# Altium schematic sheet 5V-and-3V3-ldo.SchDoc
size A; SheetNumber: 5; SheetTotal: 8
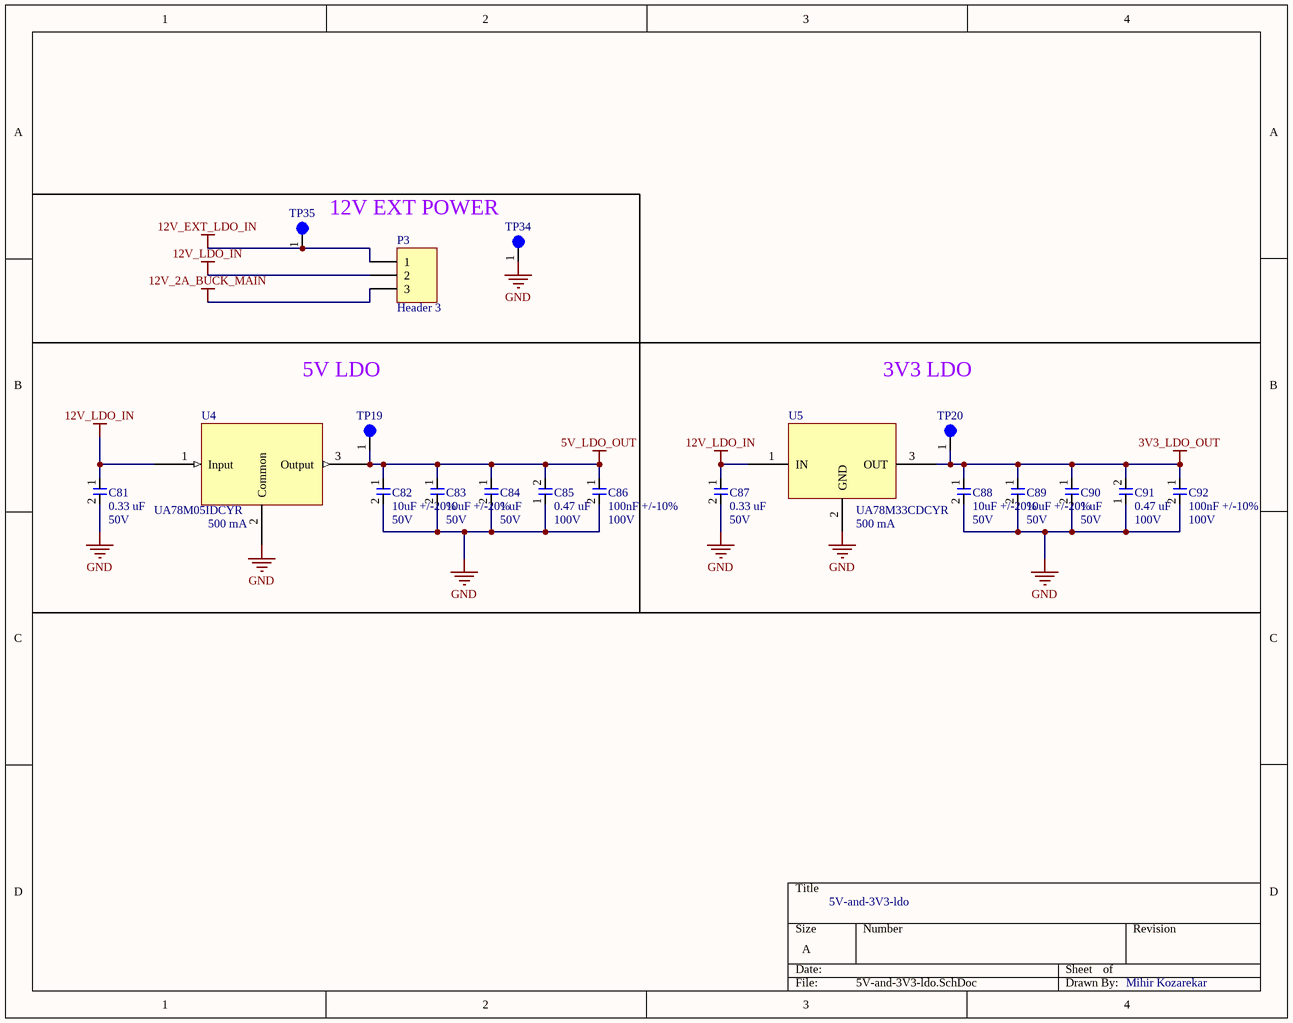
[diagram p0: 5V-and-3V3-ldo.SchDoc]

## Parts
C81  Capacitance: 0.33 uF  Voltage: 50V  [CAP-0603]  (hidden comment: CGA3E3X7R1H334K080AB)
C82  Capacitance: 10uF +/-20%  Voltage Rating: 50V  [CAP-1206]  (hidden comment: CL31B106KBHNNNE)
C83  Capacitance: 10uF +/-20%  Voltage Rating: 50V  [CAP-1206]  (hidden comment: CL31B106KBHNNNE)
C84  Capacitance: 1 uF  Voltage: 50V  [CAP-0603]  (hidden comment: UMK107AB7105KA-T)
C85  Capacitance: 0.47 uF  Voltage: 100V  [CAP-0805]  (hidden comment: KAM21KR72A474KL)
C86  Capacitance: 100nF +/-10%  Voltage Rating: 100V  [CAP-0603]  (hidden comment: CC0603KRX7R0BB104)
C87  Capacitance: 0.33 uF  Voltage: 50V  [CAP-0603]  (hidden comment: CGA3E3X7R1H334K080AB)
C88  Capacitance: 10uF +/-20%  Voltage Rating: 50V  [CAP-1206]  (hidden comment: CL31B106KBHNNNE)
C89  Capacitance: 10uF +/-20%  Voltage Rating: 50V  [CAP-1206]  (hidden comment: CL31B106KBHNNNE)
C90  Capacitance: 1 uF  Voltage: 50V  [CAP-0603]  (hidden comment: UMK107AB7105KA-T)
C91  Capacitance: 0.47 uF  Voltage: 100V  [CAP-0805]  (hidden comment: KAM21KR72A474KL)
C92  Capacitance: 100nF +/-10%  Voltage Rating: 100V  [CAP-0603]  (hidden comment: CC0603KRX7R0BB104)
P3  Header 3  [HDR1X3]
TP19  5003  [TEST-POINT-0001]  (value not drawn)
TP20  5003  [TEST-POINT-0001]  (value not drawn)
TP34  5003  [TEST-POINT-0001]  (value not drawn)
TP35  5003  [TEST-POINT-0001]  (value not drawn)
U4  UA78M05IDCYR  Current: 500 mA  [IC-SOT-223-4]
U5  UA78M33CDCYR  Current: 500 mA  [IC-SOT-223-4]

## Nets
3V3_LDO_OUT: C88.1 C89.1 C90.1 C91.2 C92.1 TP20.1 U5.3(OUT)
5V_LDO_OUT: C82.1 C83.1 C84.1 C85.2 C86.1 TP19.1 U4.3(Output)
12V_2A_BUCK_MAIN: P3.3
12V_EXT_LDO_IN: P3.1 TP35.1
12V_LDO_IN: C81.1 C87.1 P3.2 U4.1(Input) U5.1(IN)
GND: C81.2 C82.2 C83.2 C84.2 C85.1 C86.2 C87.2 C88.2 C89.2 C90.2 C91.1 C92.2 TP34.1 U4.2(Common) U5.2(GND)

## Notes on the sheet
- 12V EXT POWER
- (near TP19) 5V LDO
- (near TP20) 3V3 LDO
- 5V-and-3V3-ldo
- Mihir Kozarekar

## Library data of the parts
C81 C87 = CAP-0.33uF-0001: 0.33 µF ±10% 50V Ceramic Capacitor X7R 0603 (1608 Metric); Manufacturer: TDK Corporation; Tolerance: +/- 10%; Manufacturer Part Number: CGA3E3X7R1H334K080AB; Temperature Coefficient: X7R
C82 C83 C88 C89 = CAP-10U-0001: 10 µF ±10% 50V Ceramic Capacitor X7R 1206 (3216 Metric); Manufacturer: Samsung Electro-Mechanics; Assembled?: no; Manufacturer Part Number: CL31B106KBHNNNE; Temperature Coefficient: X7R; Package Size: 1206
C84 C90 = CAP-1U-0002: 1 µF ±10% 50V Ceramic Capacitor X7R 0603 (1608 Metric); Package Size: 0603
C85 C91 = CAP-0.47U-0001: 0.47 µF ±10% 100V Ceramic Capacitor X7R 0805 (2012 Metric); Tolerance: +/- 10%; Assembled?: No; Temperature Coefficient: X7R; Package Size: 0805
C86 C92 = CAP-100N-0001: CAP CER 0.1UF 100V X7R 0603; Manufacturer: YAGEO; Assembled?: no; Manufacturer Part Number: CC0603KRX7R0BB104; Temperature Coefficient: X7R; Package Size: 0603
P3 = Header 3: Header, 3-Pin; LatestRevisionDate: 17-Jul-2002; LatestRevisionNote: Re-released for DXP Platform.; Publisher: Altium Limited
TP19 TP20 TP34 TP35 = TEST-POINT-0001: Oranange PC Test Point, Miniature Phoisphor Bronze Silver Plating Through Hole Mounting Type
U4 = IC-LDO-5V-0003: Linear Voltage Regulator IC Positive Fixed 1 Output 500mA SOT-223-4; Manufacturer: Texas Instruments; Assembled?: no; Manufacturer Part Number: UA78M05IDCYR; Package Size: SOT223-4; Type: Low dropout (LDO)
U5 = IC-LDO-3.3V-0002: Linear Voltage Regulator IC Positive Fixed 1 Output 500mA SOT-223-4; Vin: 25V; Vout: 3.3V; Package: SOT-223-4